# Altium schematic sheet Rechargeable Circuit.SchDoc
size B; SheetNumber: 1; SheetTotal: 2
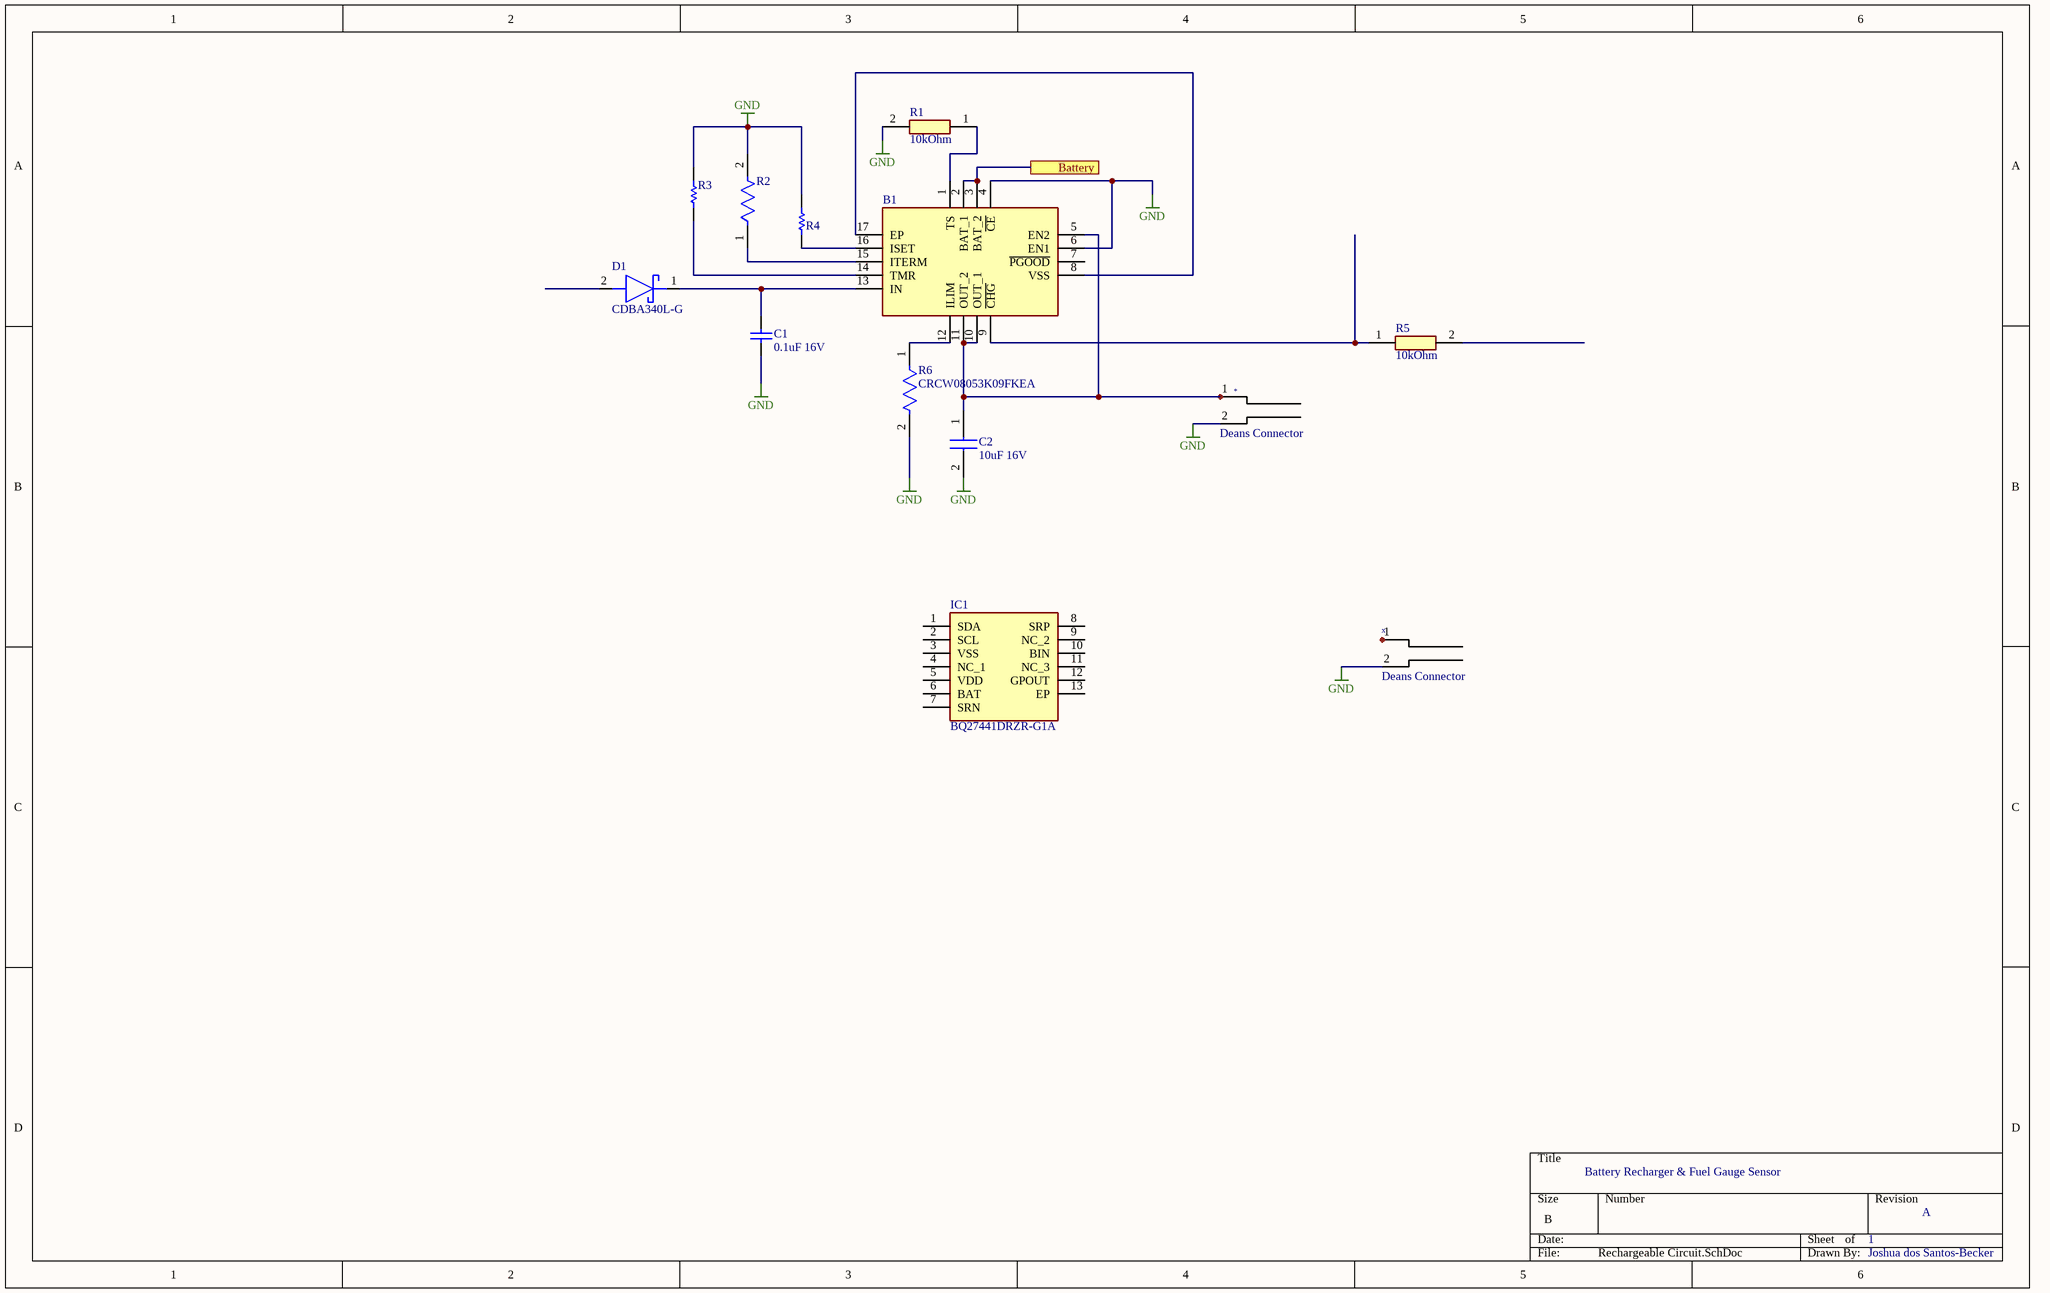
[diagram p0: Rechargeable Circuit.SchDoc]

## Parts
*  Deans Connector  [Deans]
B1  BQ24232HRGTR  [QFN50P300X300X100-17N-D]  (value not drawn)
C1  0.1uF 16V  [CAPC2113X100X50ML30T10]
C2  10uF 16V  [GRM32DR61C106KA01L]
D1  CDBA340L-G  [DIONM5127X229N]
IC1  BQ27441DRZR-G1A  [BQ27441DRZRG1A]
R1  10kOhm  [RESC6331X80N]
R2  RG2012V-1431-B-T5  [FP-RG2012-MFG]  (value not drawn)
R3  CRCW120656K2FKEA  [RESC3216X60X45ML10T20]  (value not drawn)
R4  1K74 1% 2010(5025)  [RESC2010(5025)_L]  (value not drawn)
R5  10kOhm  [RESC6331X80N]
R6  CRCW08053K09FKEA  [FP-CRCW0805-e3-IPC_C]
x  Deans Connector  [Deans]

## Ports
Battery

## Nets
GND: *.2 B1.4(~{CE}) B1.6(EN1) C1.2 C2.2 R1.2 R2.2 R3.1 R4.2 R6.2 x.2
Battery: B1.2(BAT_1) B1.3(BAT_2) ; port Battery
Net*_1: *.1 B1.5(EN2) B1.10(OUT_1) B1.11(OUT_2) C2.1
NetB1_1: B1.1(TS) R1.1
NetB1_8: B1.8(VSS) B1.17(EP)
NetB1_9: B1.9(~{CHG}) R5.1
NetB1_12: B1.12(ILIM) R6.1
NetB1_13: B1.13(IN) C1.1 D1.1(K)
NetB1_14: B1.14(TMR) R3.2
NetB1_15: B1.15(ITERM) R2.1
NetB1_16: B1.16(ISET) R4.1

Not connected (* = marked no-connect by the designer): B1 7(~{PGOOD}); D1 2(A); IC1 1(SDA) 2(SCL) 3(VSS) 4(NC_1) 5(VDD) 6(BAT) 7(SRN) 8(SRP) 9(NC_2) 10(BIN) 11(NC_3) 12(GPOUT) 13(EP); R5 2; x 1

## Notes on the sheet
- Battery Recharger & Fuel Gauge Sensor
- 1
- A
- Joshua dos Santos-Becker

## Library data of the parts
B1 = BQ24232HRGTR: USB-Friendly Lithium Based Battery Charger With Power-Path For 4.35V Batteries; Manufacturer_Name: Texas Instruments; Geometry.Height: 1mm; Mouser Part Number: 595-BQ24232HRGTR; Mouser Price/Stock: https://www.mouser.co.uk/ProductDetail/Texas-Instruments/BQ24232HRGTR?qs=sU0fTKI0LunTvrHzq76tZQ%3D%3D; Manufacturer_Part_Number: BQ24232HRGTR; Datasheet Link: http://www.ti.com/lit/gpn/bq24232h
C1 = CMP-2007-00010-1: C0805X104K4RACTU; Manufacturer: Kemet; Part Number: C0805X104K4RACTU
C2 = GRM32DR71C106KA01L: Manufacturer_Name: Murata Electronics; Datasheet Link: http://www.murata.com/~/media/webrenewal/support/library/catalog/products/capacitor/mlcc/c02e.pdf; Height: 2.2mm; Manufacturer_Part_Number: GRM32DR71C106KA01L; Mouser Part Number: 81-GRM32R71C106KA01L; Mouser Price/Stock: https://www.mouser.co.uk/ProductDetail/Murata-Electronics/GRM32DR71C106KA01L?qs=%2FV5QxPF79G3iRcxyZgnthw%3D%3D; Arrow Part Number: GRM32DR71C106KA01L; Arrow Price/Stock: https://www.arrow.com/en/products/grm32dr71c106ka01l/murata-manufacturing
D1 = CDBA340L-G: Schottky Diode; Manufacturer_Name: Comchip Technology; Datasheet Link: https://componentsearchengine.com/Datasheets/1/CDBA340L-G.pdf; Height: 2.29mm; Manufacturer_Part_Number: CDBA340L-G; Mouser Part Number: 750-CDBA340L-G; Mouser Price/Stock: https://www.mouser.co.uk/ProductDetail/Comchip-Technology/CDBA340L-G?qs=tw%252BuQ%2FB6PO0nFaxtl1KyCA%3D%3D; Arrow Part Number: CDBA340L-G; Arrow Price/Stock: https://www.arrow.com/en/products/cdba340l-g/comchip-technology?region=nac
IC1 = BQ27441DRZR-G1A: Integrated Circuit; Manufacturer_Name: Texas Instruments; Datasheet Link: http://www.ti.com/lit/gpn/bq27441-g1; Manufacturer_Part_Number: BQ27441DRZR-G1A; Mouser Part Number: 595-BQ27441DRZR-G1A; Mouser Price/Stock: https://www.mouser.co.uk/ProductDetail/Texas-Instruments/BQ27441DRZR-G1A?qs=vvk%2Fphg2gmMTlt0P9j2l8w%3D%3D; Arrow Part Number: BQ27441DRZR-G1A; Arrow Price/Stock: https://www.arrow.com/en/products/bq27441drzr-g1a/texas-instruments?region=nac
R1 R5 = CRM2512QJW-103ELF: Resistor; Manufacturer_Name: Bourns; Datasheet Link: http://www.bourns.com/data/global/pdfs/CRM0805_1206_2010.pdf; Height: 0.8mm; Manufacturer_Part_Number: CRM2512QJW-103ELF; Mouser Part Number: 652-CRM2512QJW-103E; Mouser Price/Stock: https://www.mouser.co.uk/ProductDetail/Bourns/CRM2512QJW-103ELF?qs=8Wlm6%252BaMh8Rzg3bRHdWGsA%3D%3D; Arrow Part Number: CRM2512QJW-103ELF; Arrow Price/Stock: https://www.arrow.com/en/products/crm2512qjw-103elf/bourns?region=nac
R2 = CMP-28537-000935-1: Automotive Metal Thin Film Chip Resistor, 0805, 1.43kΩ, 0.1%, 5ppm/°C, 0.125W, 150V; Power Rating: 125mW; Resistance: 1.43kR; Resistor Type: Thin Film; Package Quantity: 5000; Voltage Rating: 150V; Termination: SMD/SMT; Tolerance: 0.1%; Features: Automotive AEC-Q200; RoHS Compliant: Yes; Max Power Dissipation: 125mW; Weight: 0.000194oz; Series: RG; Case/Package: 0805; Height: 0.02inch; Width: 1.2mm; Lead Free: Lead Free; Min Operating Temperature: -55°C; Case Code (Metric): 2012; Temperature Coefficient: 5ppm/°C; Max Operating Temperature: 155°C; Packaging: Tape and Reel; Voltage Rating (DC): 150V; Number of Terminations: 2; Case Code (Imperial): 0805; Length: 0.079inch
R3 = CMP-2003-02284-1: Manufacturer: Vishay Dale; Part Number: CRCW120656K2FKEA
R4 = CMP-1017-00535-1: 1K74 0.75W 1% 2010 (5025 Metric)  SMD; Case-Metric: 5025; Case-EIA: 2010; Value: 1740.00 Ohm; Power: 0.75 W; Tolerance: 1 %; Technology: SMT
R6 = CMP-2001-03873-2: RES Thick Film, 3.09kΩ, 1%, 0.125W, 100ppm/°C, 0805; Max Power Dissipation: 125mW; Voltage Rating (DC): 150V; Resistance: 3.09kR; Power Rating: 125mW; Package Quantity: 10; Height: 0.02inch; Min Operating Temperature: -55°C; Number of Terminations: 2; Case Code (Metric): 2012; Case/Package: 0805; Composition: Thick Film; Max Operating Temperature: 155°C; Tolerance: 1%; Depth: 1.25mm; Number of Pins: 2; Packaging: Tape and Reel; Width: 0.049inch; Temperature Coefficient: 100ppm/°C; Voltage Rating: 150V; Military Standard: Not; Weight: 0.000194oz; Features: Automotive AEC-Q200; Case Code (Imperial): 0805; Radiation Hardening: No; Contact Plating: Tin; Lead Free: Lead Free; Length: 2mm; Termination: Solder